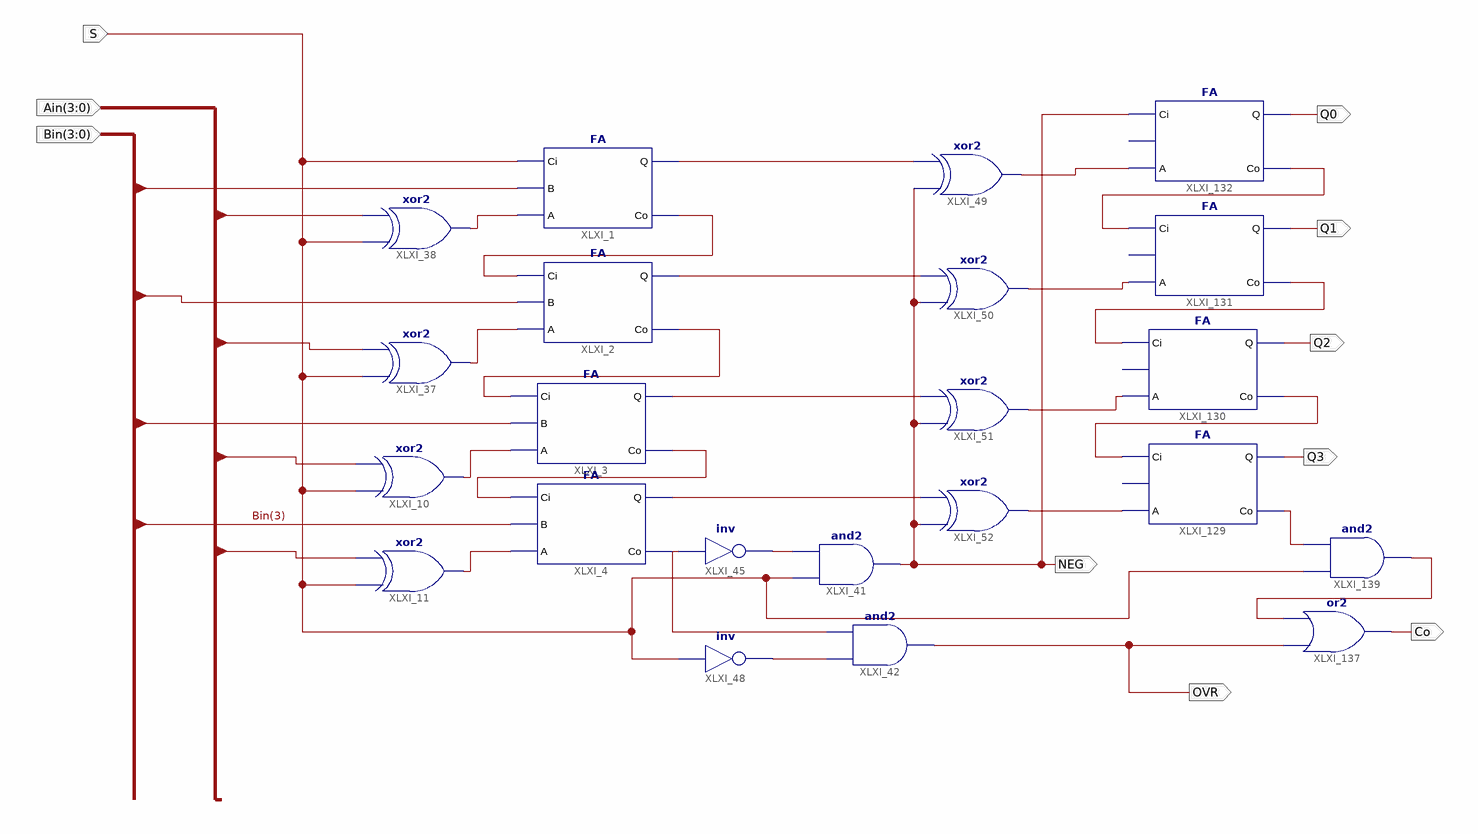
[diagram p0: schematic sheet 1]
// Xilinx ISE schematic PFA.sch (spartan3e) as structural Verilog: 22 symbols, 10 ports
module PFA (
  input  [3:0] Bin,
  input  S,
  input  [3:0] Ain,
  output OVR,
  output Q3,
  output NEG,
  output Q2,
  output Q1,
  output Q0,
  output Co
);

  wire XLXN_34, XLXN_70, XLXN_71, XLXN_163, XLXN_164, XLXN_165, XLXN_170, XLXN_177, XLXN_180, XLXN_181,
       XLXN_191, XLXN_192, XLXN_194, XLXN_374, XLXN_375, XLXN_376, XLXN_377, XLXN_378, XLXN_379, XLXN_383,
       XLXN_392, XLXN_403, XLXN_406;

  xor XLXI_11 (XLXN_163, S, Ain[3]);
  xor XLXI_10 (XLXN_164, S, Ain[2]);
  xor XLXI_37 (XLXN_165, S, Ain[1]);
  xor XLXI_38 (XLXN_170, S, Ain[0]);
  and XLXI_42 (OVR, XLXN_177, XLXN_180);
  not XLXI_48 (XLXN_177, S);
  FA XLXI_4 (.Ci(XLXN_70), .B(Bin[3]), .A(XLXN_163), .Q(XLXN_194), .Co(XLXN_180));
  FA XLXI_3 (.Ci(XLXN_34), .B(Bin[2]), .A(XLXN_164), .Q(XLXN_392), .Co(XLXN_70));
  FA XLXI_2 (.Ci(XLXN_71), .B(Bin[1]), .A(XLXN_165), .Q(XLXN_192), .Co(XLXN_34));
  FA XLXI_1 (.Ci(S), .B(Bin[0]), .A(XLXN_170), .Q(XLXN_191), .Co(XLXN_71));
  xor XLXI_50 (XLXN_379, NEG, XLXN_192);
  and XLXI_41 (NEG, S, XLXN_181);
  not XLXI_45 (XLXN_181, XLXN_180);
  xor XLXI_52 (XLXN_377, NEG, XLXN_194);
  xor XLXI_51 (XLXN_378, NEG, XLXN_392);
  xor XLXI_49 (XLXN_383, NEG, XLXN_191);
  FA XLXI_131 (.Ci(XLXN_376), .A(XLXN_379), .Q(Q1), .Co(XLXN_375));  // open: B
  FA XLXI_132 (.Ci(NEG), .A(XLXN_383), .Q(Q0), .Co(XLXN_376));  // open: B
  FA XLXI_130 (.Ci(XLXN_375), .A(XLXN_378), .Q(Q2), .Co(XLXN_374));  // open: B
  FA XLXI_129 (.Ci(XLXN_374), .A(XLXN_377), .Q(Q3), .Co(XLXN_403));  // open: B
  or XLXI_137 (Co, OVR, XLXN_406);
  and XLXI_139 (XLXN_406, S, XLXN_403);
endmodule
